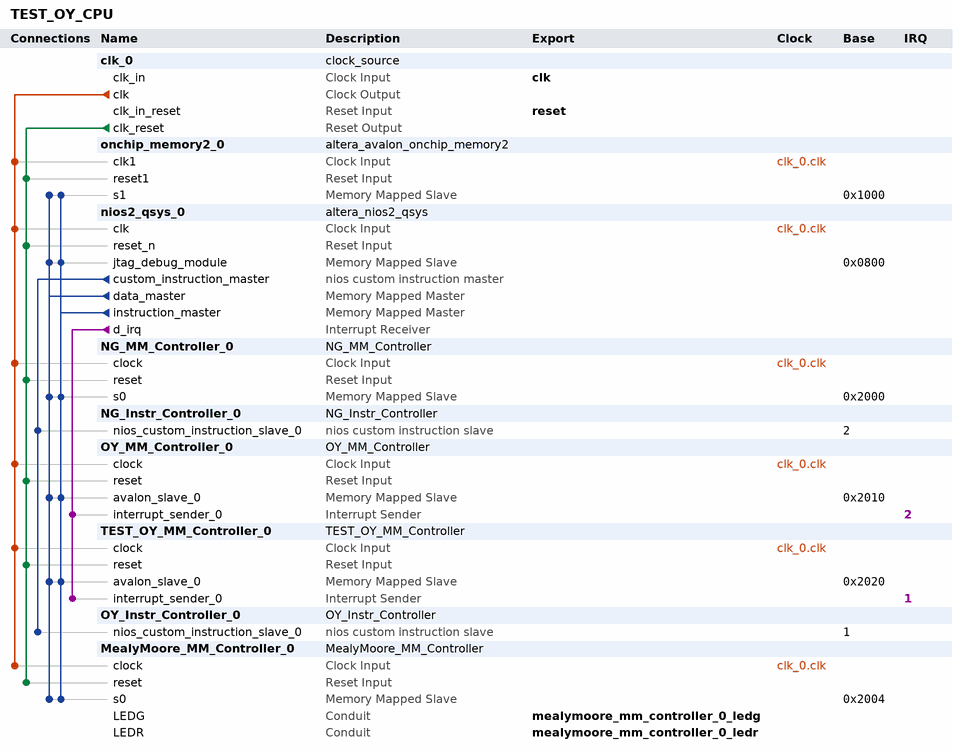
[diagram p0: system contents]
# Platform Designer (Qsys) system TEST_OY_CPU, Cyclone IV E EP4CE115F29C7
# Parameters at their usual value, and those the tool derives, are not listed.
package require -exact qsys 13.0
create_system TEST_OY_CPU
set_project_property DEVICE_FAMILY {Cyclone IV E}
set_project_property DEVICE EP4CE115F29C7

add_instance clk_0 clock_source 13.0
set_instance_parameter_value clk_0 clockFrequency 50000000

add_instance onchip_memory2_0 altera_avalon_onchip_memory2 13.0.1.99.2
set_instance_parameter_value onchip_memory2_0 dataWidth 32
set_instance_parameter_value onchip_memory2_0 dualPort false
set_instance_parameter_value onchip_memory2_0 initMemContent true
set_instance_parameter_value onchip_memory2_0 initializationFileName onchip_mem.hex
set_instance_parameter_value onchip_memory2_0 memorySize 4096

add_instance nios2_qsys_0 altera_nios2_qsys 13.0
set_instance_parameter_value nios2_qsys_0 resetSlave onchip_memory2_0.s1
set_instance_parameter_value nios2_qsys_0 mmu_TLBMissExcSlave None
set_instance_parameter_value nios2_qsys_0 exceptionSlave onchip_memory2_0.s1
set_instance_parameter_value nios2_qsys_0 breakSlave nios2_qsys_0.jtag_debug_module
set_instance_parameter_value nios2_qsys_0 impl Tiny
set_instance_parameter_value nios2_qsys_0 icache_size 4096

add_instance NG_MM_Controller_0 NG_MM_Controller 1.0

add_instance NG_Instr_Controller_0 NG_Instr_Controller 1.0

add_instance OY_MM_Controller_0 OY_MM_Controller 1.0
set_instance_parameter_value OY_MM_Controller_0 n 16

add_instance TEST_OY_MM_Controller_0 TEST_OY_MM_Controller 1.0
set_instance_parameter_value TEST_OY_MM_Controller_0 n 16

add_instance OY_Instr_Controller_0 OY_Instr_Controller 1.0
set_instance_parameter_value OY_Instr_Controller_0 n 16

add_instance MealyMoore_MM_Controller_0 MealyMoore_MM_Controller 1.0

# connections
add_connection clk_0.clk MealyMoore_MM_Controller_0.clock clock
add_connection clk_0.clk NG_MM_Controller_0.clock clock
add_connection clk_0.clk nios2_qsys_0.clk clock
add_connection clk_0.clk onchip_memory2_0.clk1 clock
add_connection clk_0.clk OY_MM_Controller_0.clock clock
add_connection clk_0.clk TEST_OY_MM_Controller_0.clock clock
add_connection clk_0.clk_reset MealyMoore_MM_Controller_0.reset reset
add_connection clk_0.clk_reset NG_MM_Controller_0.reset reset
add_connection clk_0.clk_reset nios2_qsys_0.reset_n reset
add_connection clk_0.clk_reset onchip_memory2_0.reset1 reset
add_connection clk_0.clk_reset OY_MM_Controller_0.reset reset
add_connection clk_0.clk_reset TEST_OY_MM_Controller_0.reset reset
add_connection nios2_qsys_0.data_master MealyMoore_MM_Controller_0.s0 avalon
set_connection_parameter_value nios2_qsys_0.data_master/MealyMoore_MM_Controller_0.s0 baseAddress 0x2004
add_connection nios2_qsys_0.data_master NG_MM_Controller_0.s0 avalon
set_connection_parameter_value nios2_qsys_0.data_master/NG_MM_Controller_0.s0 baseAddress 0x2000
add_connection nios2_qsys_0.data_master nios2_qsys_0.jtag_debug_module avalon
set_connection_parameter_value nios2_qsys_0.data_master/nios2_qsys_0.jtag_debug_module baseAddress 0x0800
add_connection nios2_qsys_0.data_master onchip_memory2_0.s1 avalon
set_connection_parameter_value nios2_qsys_0.data_master/onchip_memory2_0.s1 baseAddress 0x1000
add_connection nios2_qsys_0.data_master OY_MM_Controller_0.avalon_slave_0 avalon
set_connection_parameter_value nios2_qsys_0.data_master/OY_MM_Controller_0.avalon_slave_0 baseAddress 0x2010
add_connection nios2_qsys_0.data_master TEST_OY_MM_Controller_0.avalon_slave_0 avalon
set_connection_parameter_value nios2_qsys_0.data_master/TEST_OY_MM_Controller_0.avalon_slave_0 baseAddress 0x2020
add_connection nios2_qsys_0.instruction_master MealyMoore_MM_Controller_0.s0 avalon
set_connection_parameter_value nios2_qsys_0.instruction_master/MealyMoore_MM_Controller_0.s0 baseAddress 0x2004
add_connection nios2_qsys_0.instruction_master NG_MM_Controller_0.s0 avalon
set_connection_parameter_value nios2_qsys_0.instruction_master/NG_MM_Controller_0.s0 baseAddress 0x2000
add_connection nios2_qsys_0.instruction_master nios2_qsys_0.jtag_debug_module avalon
set_connection_parameter_value nios2_qsys_0.instruction_master/nios2_qsys_0.jtag_debug_module baseAddress 0x0800
add_connection nios2_qsys_0.instruction_master onchip_memory2_0.s1 avalon
set_connection_parameter_value nios2_qsys_0.instruction_master/onchip_memory2_0.s1 baseAddress 0x1000
add_connection nios2_qsys_0.instruction_master OY_MM_Controller_0.avalon_slave_0 avalon
set_connection_parameter_value nios2_qsys_0.instruction_master/OY_MM_Controller_0.avalon_slave_0 baseAddress 0x2010
add_connection nios2_qsys_0.instruction_master TEST_OY_MM_Controller_0.avalon_slave_0 avalon
set_connection_parameter_value nios2_qsys_0.instruction_master/TEST_OY_MM_Controller_0.avalon_slave_0 baseAddress 0x2020
add_connection nios2_qsys_0.d_irq OY_MM_Controller_0.interrupt_sender_0 interrupt
set_connection_parameter_value nios2_qsys_0.d_irq/OY_MM_Controller_0.interrupt_sender_0 irqNumber 2
add_connection nios2_qsys_0.d_irq TEST_OY_MM_Controller_0.interrupt_sender_0 interrupt
set_connection_parameter_value nios2_qsys_0.d_irq/TEST_OY_MM_Controller_0.interrupt_sender_0 irqNumber 1
add_connection nios2_qsys_0.custom_instruction_master NG_Instr_Controller_0.nios_custom_instruction_slave_0 nios_custom_instruction
set_connection_parameter_value nios2_qsys_0.custom_instruction_master/NG_Instr_Controller_0.nios_custom_instruction_slave_0 CIName ng_instr_controller_0
set_connection_parameter_value nios2_qsys_0.custom_instruction_master/NG_Instr_Controller_0.nios_custom_instruction_slave_0 baseAddress 2
add_connection nios2_qsys_0.custom_instruction_master OY_Instr_Controller_0.nios_custom_instruction_slave_0 nios_custom_instruction
set_connection_parameter_value nios2_qsys_0.custom_instruction_master/OY_Instr_Controller_0.nios_custom_instruction_slave_0 CIName oy_instr_controller_0
set_connection_parameter_value nios2_qsys_0.custom_instruction_master/OY_Instr_Controller_0.nios_custom_instruction_slave_0 baseAddress 1

# exported interfaces
add_interface clk clock sink
set_interface_property clk EXPORT_OF clk_0.clk_in
add_interface reset reset sink
set_interface_property reset EXPORT_OF clk_0.clk_in_reset
add_interface mealymoore_mm_controller_0_ledr conduit end
set_interface_property mealymoore_mm_controller_0_ledr EXPORT_OF MealyMoore_MM_Controller_0.LEDR
add_interface mealymoore_mm_controller_0_ledg conduit end
set_interface_property mealymoore_mm_controller_0_ledg EXPORT_OF MealyMoore_MM_Controller_0.LEDG

set_interconnect_requirement {$system} qsys_mm.clockCrossingAdapter HANDSHAKE
set_interconnect_requirement {$system} qsys_mm.maxAdditionalLatency 1
set_interconnect_requirement {$system} qsys_mm.enableEccProtection FALSE
set_interconnect_requirement {$system} qsys_mm.insertDefaultSlave FALSE

save_system TEST_OY_CPU.qsys
